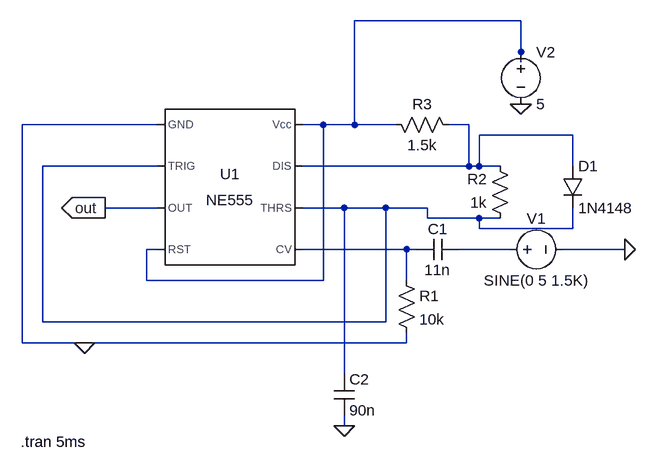
[diagram p0: schematic FM modulation.asc]
FM modulation.asc, the LTspice schematic file:
Version 4
SHEET 1 880 680
WIRE 656 -80 400 -80
WIRE 656 -32 656 -80
WIRE 656 -16 656 -32
WIRE 96 80 -112 80
WIRE 352 80 320 80
WIRE 400 80 400 -80
WIRE 400 80 352 80
WIRE 464 80 400 80
WIRE 576 80 544 80
WIRE 736 96 592 96
WIRE 96 144 -80 144
WIRE 576 144 576 80
WIRE 576 144 320 144
WIRE 592 144 592 96
WIRE 592 144 576 144
WIRE 624 144 592 144
WIRE 736 144 736 96
WIRE 96 208 16 208
WIRE 384 208 320 208
WIRE 448 208 384 208
WIRE 512 208 448 208
WIRE 512 224 512 208
WIRE 592 224 512 224
WIRE 624 224 592 224
WIRE 592 240 592 224
WIRE 736 240 736 208
WIRE 736 240 592 240
WIRE 96 272 80 272
WIRE 480 272 320 272
WIRE 496 272 480 272
WIRE 640 272 560 272
WIRE 816 272 720 272
WIRE 80 320 80 272
WIRE 352 320 352 80
WIRE 352 320 80 320
WIRE 480 320 480 272
WIRE -80 384 -80 144
WIRE 448 384 448 208
WIRE 448 384 -80 384
WIRE -112 416 -112 80
WIRE -16 416 -112 416
WIRE 480 416 480 400
WIRE 480 416 -16 416
WIRE 384 464 384 208
WIRE 384 544 384 528
FLAG 16 208 out
IOPIN 16 208 Out
FLAG 656 48 0
FLAG 816 272 0
FLAG -16 416 0
FLAG 384 544 0
SYMBOL Misc\\NE555 208 176 R0
SYMATTR InstName U1
SYMBOL res 448 64 M90
WINDOW 0 0 56 VBottom 2
WINDOW 3 32 56 VTop 2
SYMATTR InstName R3
SYMATTR Value 1.5k
SYMBOL res 640 240 R180
WINDOW 0 36 76 Left 2
WINDOW 3 36 40 Left 2
SYMATTR InstName R2
SYMATTR Value 1k
SYMBOL voltage 656 -48 R0
WINDOW 123 0 0 Left 0
WINDOW 39 0 0 Left 0
SYMATTR InstName V2
SYMATTR Value 5
SYMBOL cap 560 256 R90
WINDOW 0 0 32 VBottom 2
WINDOW 3 32 32 VTop 2
SYMATTR InstName C1
SYMATTR Value 11n
SYMBOL voltage 624 272 R270
WINDOW 0 32 56 VTop 2
WINDOW 3 -32 56 VBottom 2
WINDOW 123 0 0 Left 0
WINDOW 39 0 0 Left 0
SYMATTR InstName V1
SYMATTR Value SINE(0 5 1.5K)
SYMBOL res 464 304 R0
SYMATTR InstName R1
SYMATTR Value 10k
SYMBOL diode 720 144 R0
SYMATTR InstName D1
SYMATTR Value 1N4148
SYMBOL cap 368 464 R0
SYMATTR InstName C2
SYMATTR Value 90n
TEXT -114 568 Left 2 !.tran 5ms

The netlist it stands for:
* FM modulation.asc
XU1 0 N003 out N001 N004 N003 N002 N001 NE555  ; pins GND TRIG OUT RST CV THRS DIS Vcc
R3 N001 N002 1.5k
R2 N003 N002 1k
V2 N001 0 5
C1 N005 N004 11n
V1 N005 0 SINE(0 5 1.5K)
R1 N004 0 10k
D1 N002 N003 1N4148
C2 N003 0 90n
.model D D
.lib standard.dio
.tran 5ms
.lib NE555.sub
.backanno
.end